# EAGLE design irisc (EAGLE 9.2.2)
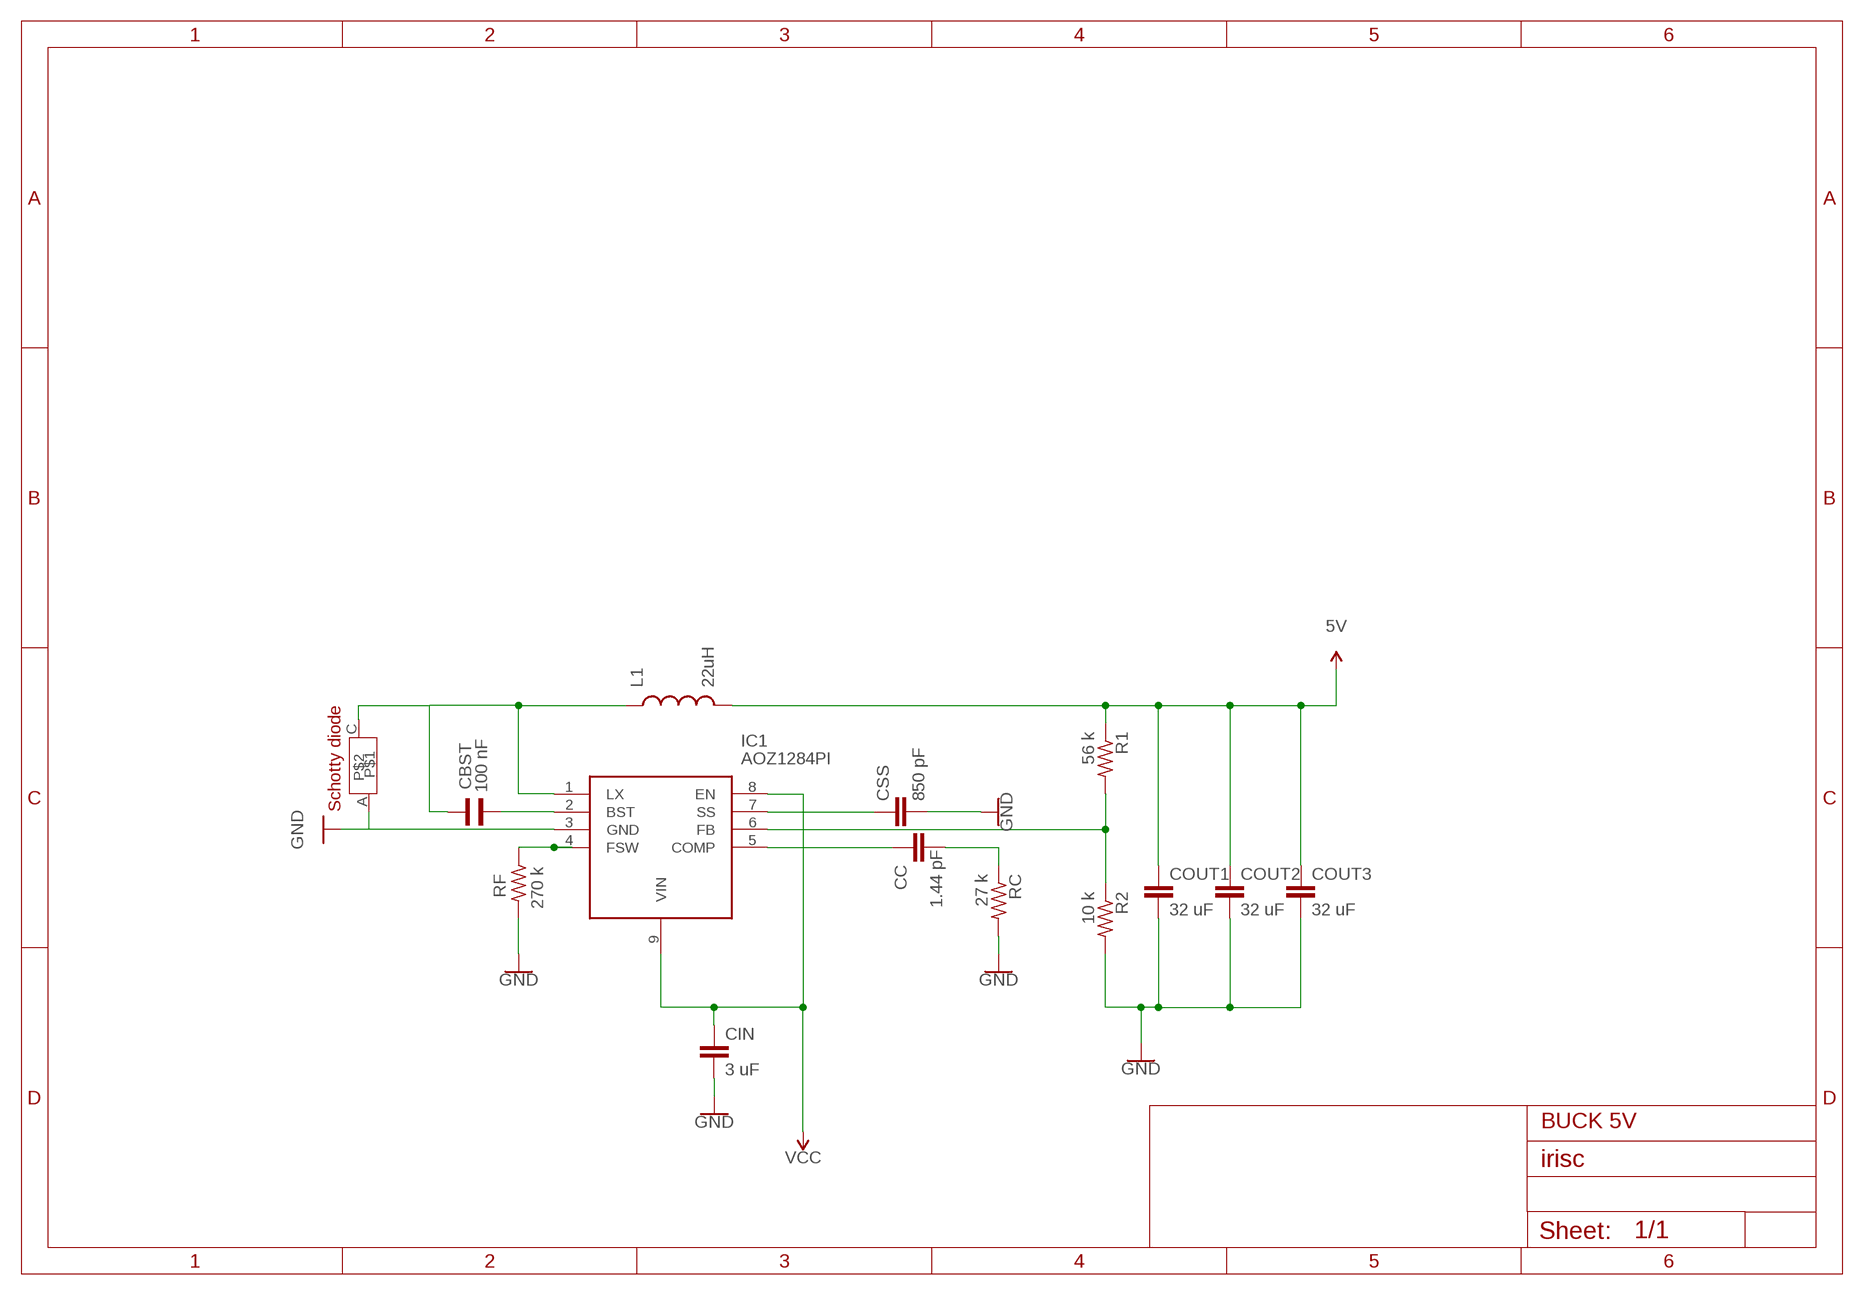
[diagram p0: schematic, sheet 1]

## Parts
CBST  100 nF  WCAP-CSGP_0805_885012006018_WAVE  [WCAP-CSGP_0805_WAVE]
CC  1.44 pF  CC1206  [C1206]
CIN  3 uF  CC1210  [C1210]
COUT1  32 uF  CC1812  [C1812]
COUT2  32 uF  CC1812  [C1812]
COUT3  32 uF  CC1812  [C1812]
CSS  850 pF  C  [C0805]
IC1  AOZ1284PI  [SOIC127P600X170-9N]
L1  22uH  INDUCTOR  [L0603]
R1  56 k  FLIPFLOP-RES  [0805-THM]
R2  10 k  FLIPFLOP-RES  [0805-THM]
RC  27 k  FLIPFLOP-RES  [0805-THM]
RF  270 k  FLIPFLOP-RES  [0805-THM]
U$1  SCHOTTY-DIODE-IRISC  [DO-214AC]

## Nets
5V: COUT1.1 COUT2.1 COUT3.1 L1.2 R1.1
GND: CIN.2 COUT1.2 COUT2.2 COUT3.2 CSS.2 IC1.3(GND) R2.2 RC.2 RF.2 U$1.A
N$1: CSS.1 IC1.7(SS)
N$2: IC1.4(FSW) RF.1
N$3: CBST.2 IC1.2(BST)
N$4: CBST.1 IC1.1(LX) L1.1 U$1.C
N$6: CC.1 IC1.5(COMP)
N$140: IC1.6(FB) R1.2 R2.1
N$141: CC.2 RC.1
VCC: CIN.1 IC1.8(EN) IC1.9(VIN)

## Notes on the sheet
- BUCK 5V

## Library data of the parts
CBST = Wurth_Elektronik_Passive_Capacitors_rev18b:WCAP-CSGP_0805: WCAP-CSGP Ceramic Capacitors Characteristics Multilayer Ceramic Chip Capacitor Recommended soldering:Reflow, for 0603 and 0805 wave soldering is also allowed Operating temperature:-55 °C to +125 °C; Ceramic characteristics: Class I - NPO ; Class II -X7R, X5R High performance ceramic High capacitance stability Minimal aging Termination:Cu/Ni/Sn <http://katalog.we-online.de/media/images/eisos/WCAP-CSGP_pf2.jpg> Details see: http://katalog.we-online.de/en/pbs/WCAP-CSGP-0805? Created: 2015-01-28 2015 (C) Wurth Elektronik; SPICEPREFIX: C
CC CIN COUT1-COUT3 CSS = eagle-ltspice:C: CAPACITOR, European symbol; SPICEMODEL: NONE; SPICEPREFIX: C
IC1 = AOZ1284PI:AOZ1284PI: IC REG BUCK ADJ 4A 8SO Source: Datasheet <http://datasheet.octopart.com/AOZ1284PI-Alpha-&-Omega-Semiconductor-datasheet-68364838.pdf>; DESCRIPTION: IC REG BUCK ADJ 4A 8SO; HEIGHT: 1.7mm; MANUFACTURER_NAME: Alpha & Omega Semiconductors; MANUFACTURER_PART_NUMBER: AOZ1284PI
L1 = BeagleBone_Blue_R3:INDUCTOR: Inductors Basic Inductor/Choke - 0603 and 1206. Footprints are not proven and vary greatly between part numbers. SRN6045- 33uH, 20% 1.4A
R1 R2 RC RF = adafruit:FLIPFLOP-RES: Flip Flop resistor An 0805 resistor inside a standard 1/4W 5% resistor. Makes for easy mods; SPICEPREFIX: R
U$1 = DO-214AC:SCHOTTY-DIODE-IRISC: Footprint : DO-214AB ,8 A, 60 V

## Board
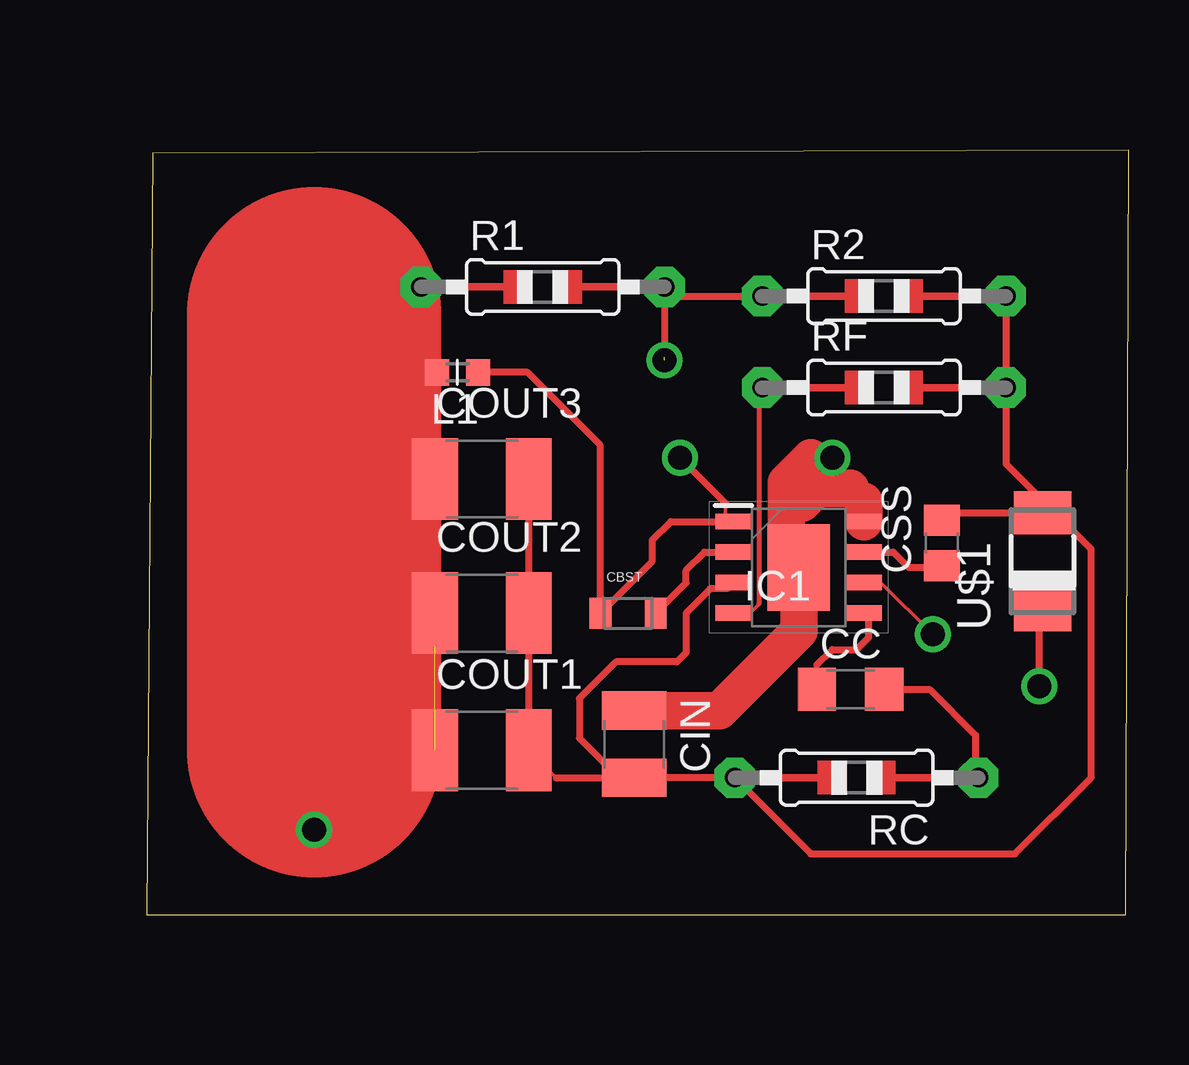
[diagram p1: board, top side]
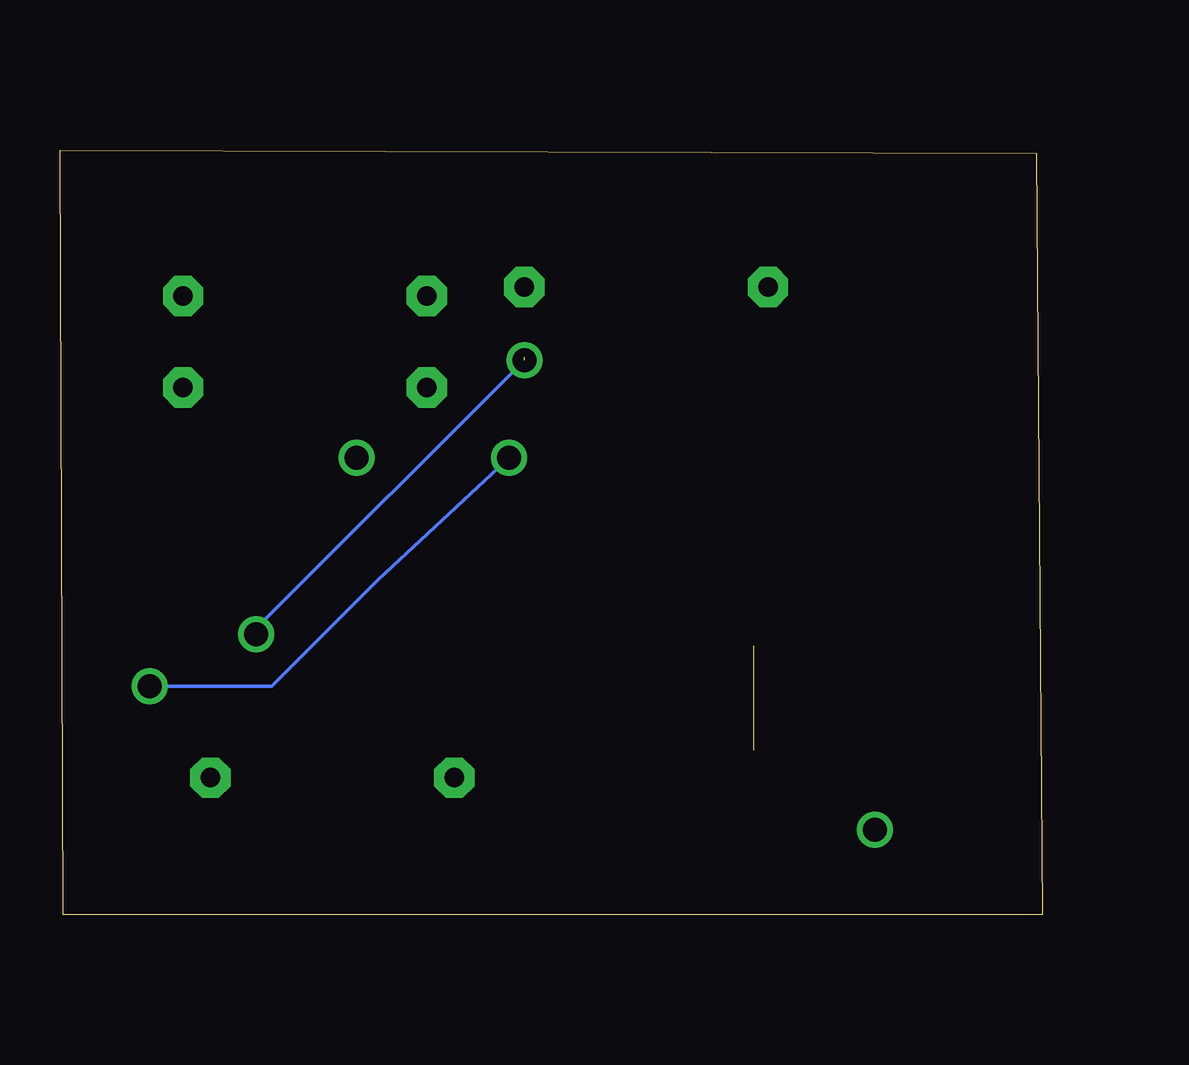
[diagram p2: board, bottom side, seen from below]

Size 40.95 x 31.87 mm. Coordinates in mm from the lower left corner, seen from the top.
Outline: 0,0 40.82,0 40.95,31.87 0.25,31.74 0,0
Copper layers (1*16): Top 0.035mm / dielectric 1.5mm / Bottom 0.035mm
Design rules "default": minimum track width 6mil, minimum drill 0.35mm, track to track 6mil, track to pad 6mil, pad to pad 6mil, via to via 6mil, smd to smd 6mil, copper to edge 40mil, drill to drill 6mil, minimum pad ring 10mil, minimum via ring 8mil, stop-mask expansion 4mil, vias tented up to drill 0mil, thermal gap 10mil

### Footprints (pad centres in the part's own frame; a part is rotated, then mirrored left to right if it is on the bottom)
WCAP-CSGP_0805_WAVE = smd 0.9 x 1.3: 1 -1.15,0; 2 1.15,0
C1206 = smd 1.6 x 1.8: 1 -1.4,0; 2 1.4,0
C1210 = smd 1.6 x 2.7: 1 -1.4,0; 2 1.4,0
C1812 = smd 1.9 x 3.4: 1 -1.95,0; 2 1.95,0
C0805 = smd 1.3 x 1.5: 1 -0.95,0; 2 0.95,0
SOIC127P600X170-9N = smd 1.525 x 0.65: 1 -2.712,1.905; 2 -2.712,0.635; 3 -2.712,-0.635; 4 -2.712,-1.905; 5 2.712,-1.905; 6 2.712,-0.635; 7 2.712,0.635; 8 2.712,1.905 | smd 2.61 x 3.6: 9 0,0
L0603 = smd 1 x 1.1: 1 -0.85,0; 2 0.85,0
0805-THM = drill 0.813 pad 1.676 octagon: 1 -5.08,0; 2 5.08,0
DO-214AC = smd 1.8 x 2.4: A 2.025,0; C -2.025,0

### Placement (x,y rotation side)
CBST  20.07,12.57 0 top
CC  29.34,9.4 0 top
CIN  20.32,7.11 270 top
COUT1  13.97,6.86 0 top
COUT2  13.97,12.57 0 top
COUT3  13.97,18.16 0 top
CSS  33.15,15.49 90 top
IC1  27.18,14.48 0 top
L1  12.95,22.61 180 top
R1  16.51,26.16 0 top
R2  30.73,25.78 0 top
RC  29.59,5.71 180 top
RF  30.73,21.97 0 top
U$1  37.34,14.73 90 top

### Tracks (layer width: path | path; a pad name or v marks a point on that pad's centre or on a via)
5V  (via drill 1)  (1 unrouted)
  Top 0.152: 12.02,11.22 11.43,11.81 11.43,11.98 COUT2.1 | 11.38,26.12 R1.1 8.51,26.16 7.37,25.02 | 12.57,18.41 12.32,18.16 COUT3.1 7.19,22.99 7.11,22.99 | COUT1.1 6.99,6.86 v6.99,3.56 | 7.37,25.02 9.69,25.02 L1.2 8.26,22.61 | 7.37,25.02 6.99,25.02 6.99,23.11 7.11,22.99 | 8.26,22.61 7.49,23.37 | 8.26,22.61 9.27,21.59 9.27,20.83 7.11,22.99
  Top 10.6: 6.99,6.86 6.99,25.02
GND
  Top 0.152: COUT1.2 17.07,5.71 | CIN.2 19.68,5.71 | IC1.3 24.21,13.59 | CSS.2 33.46,16.76 | 37.85,16.76 U$1.A
  Top 0.3: COUT3.2 COUT2.2 COUT1.2 | 17.07,5.71 19.68,5.71 | CIN.2 RC.2 27.69,2.54 36.2,2.54 39.37,5.71 39.37,15.24 37.85,16.76 35.81,18.8 RF.2 R2.2 | 24.21,13.59 23.5,13.59 22.48,12.57 22.48,10.92 22.1,10.54 19.56,10.54 18.03,9.02 18.03,7.37 19.68,5.71 | 33.46,16.76 U$1.A
N$1
  Top 0.152: 33.08,14.48 CSS.1
  Top 0.3: IC1.7 31.11,15.11 31.75,14.48 33.08,14.48
N$2
  Top 0.152: IC1.4 24.59,12.7 25.27,12.7 25.52,12.94
  Top 0.2: 25.52,21.83 25.52,12.94
  Top 0.3: 25.52,21.83 RF.1
N$3
  Top 0.3: CBST.2 22.48,13.84 22.48,14.35 23.24,15.11 IC1.2
N$4  (via drill 1)
  Top 0.152: L1.1 13.84,22.57 | IC1.1 24.13,16.72 24.13,17.14 | 37.21,12.58 U$1.C
  Top 0.3: 24.13,17.14 v22.23,19.05 | v37.21,9.53 37.21,12.58 | L1.1 15.88,22.61 18.92,19.57 CBST.1 21.08,14.74 21.08,15.62 21.84,16.38 IC1.1
  Bottom 0.152: v37.21,9.53 32.13,9.53 27.69,13.97 22.35,18.92 v22.23,19.05
N$6
  Top 0.152: CC.1 27.94,10.41 | 30.1,12.36 IC1.5
  Top 0.3: 27.94,10.41 28.57,11.05 29.59,11.05 30.1,11.56 30.1,12.36
N$140  (via drill 1)  (1 unrouted)
  Top 0.152: IC1.6 30.61,13.84 v32.77,11.68 | R1.2 21.97,25.78
  Top 0.3: 21.97,25.78 R2.1 | R1.2 21.59,23.24
  Bottom 0.152: v32.77,11.68 32.77,11.94 v21.59,23.11
N$141
  Top 0.152: 34.54,5.84 RC.1
  Top 0.3: CC.2 32.64,9.4 34.54,7.49 34.54,5.84
VCC  (via drill 1)
  Top 0.152: 29.89,17.23 29.34,17.78 | 27.3,17.14 27.3,14.61 IC1.9 26.67,14.99 | 27.69,19.05 v28.57,19.05
  Top 1.56: IC1.8 29.89,17.23 | 29.34,17.78 27.94,17.78 27.3,17.14 | IC1.9 27.18,11.81 23.88,8.51 CIN.1 | 26.67,14.99 26.67,18.03 27.69,19.05